# Altium schematic sheet POWER+HALL.SchDoc (part 1 of 3)
size B; CompanyName: Microchip Technology Inc.; Organization: Microchip Technology; Address1: 2355 West Chandler Blvd.; Address2: Chandler, AZ  85224; Address4: USA; DocumentNumber: 3; SheetNumber: 3; SheetTotal: 3; SheetTitle: POWER+HALL; Time: Time
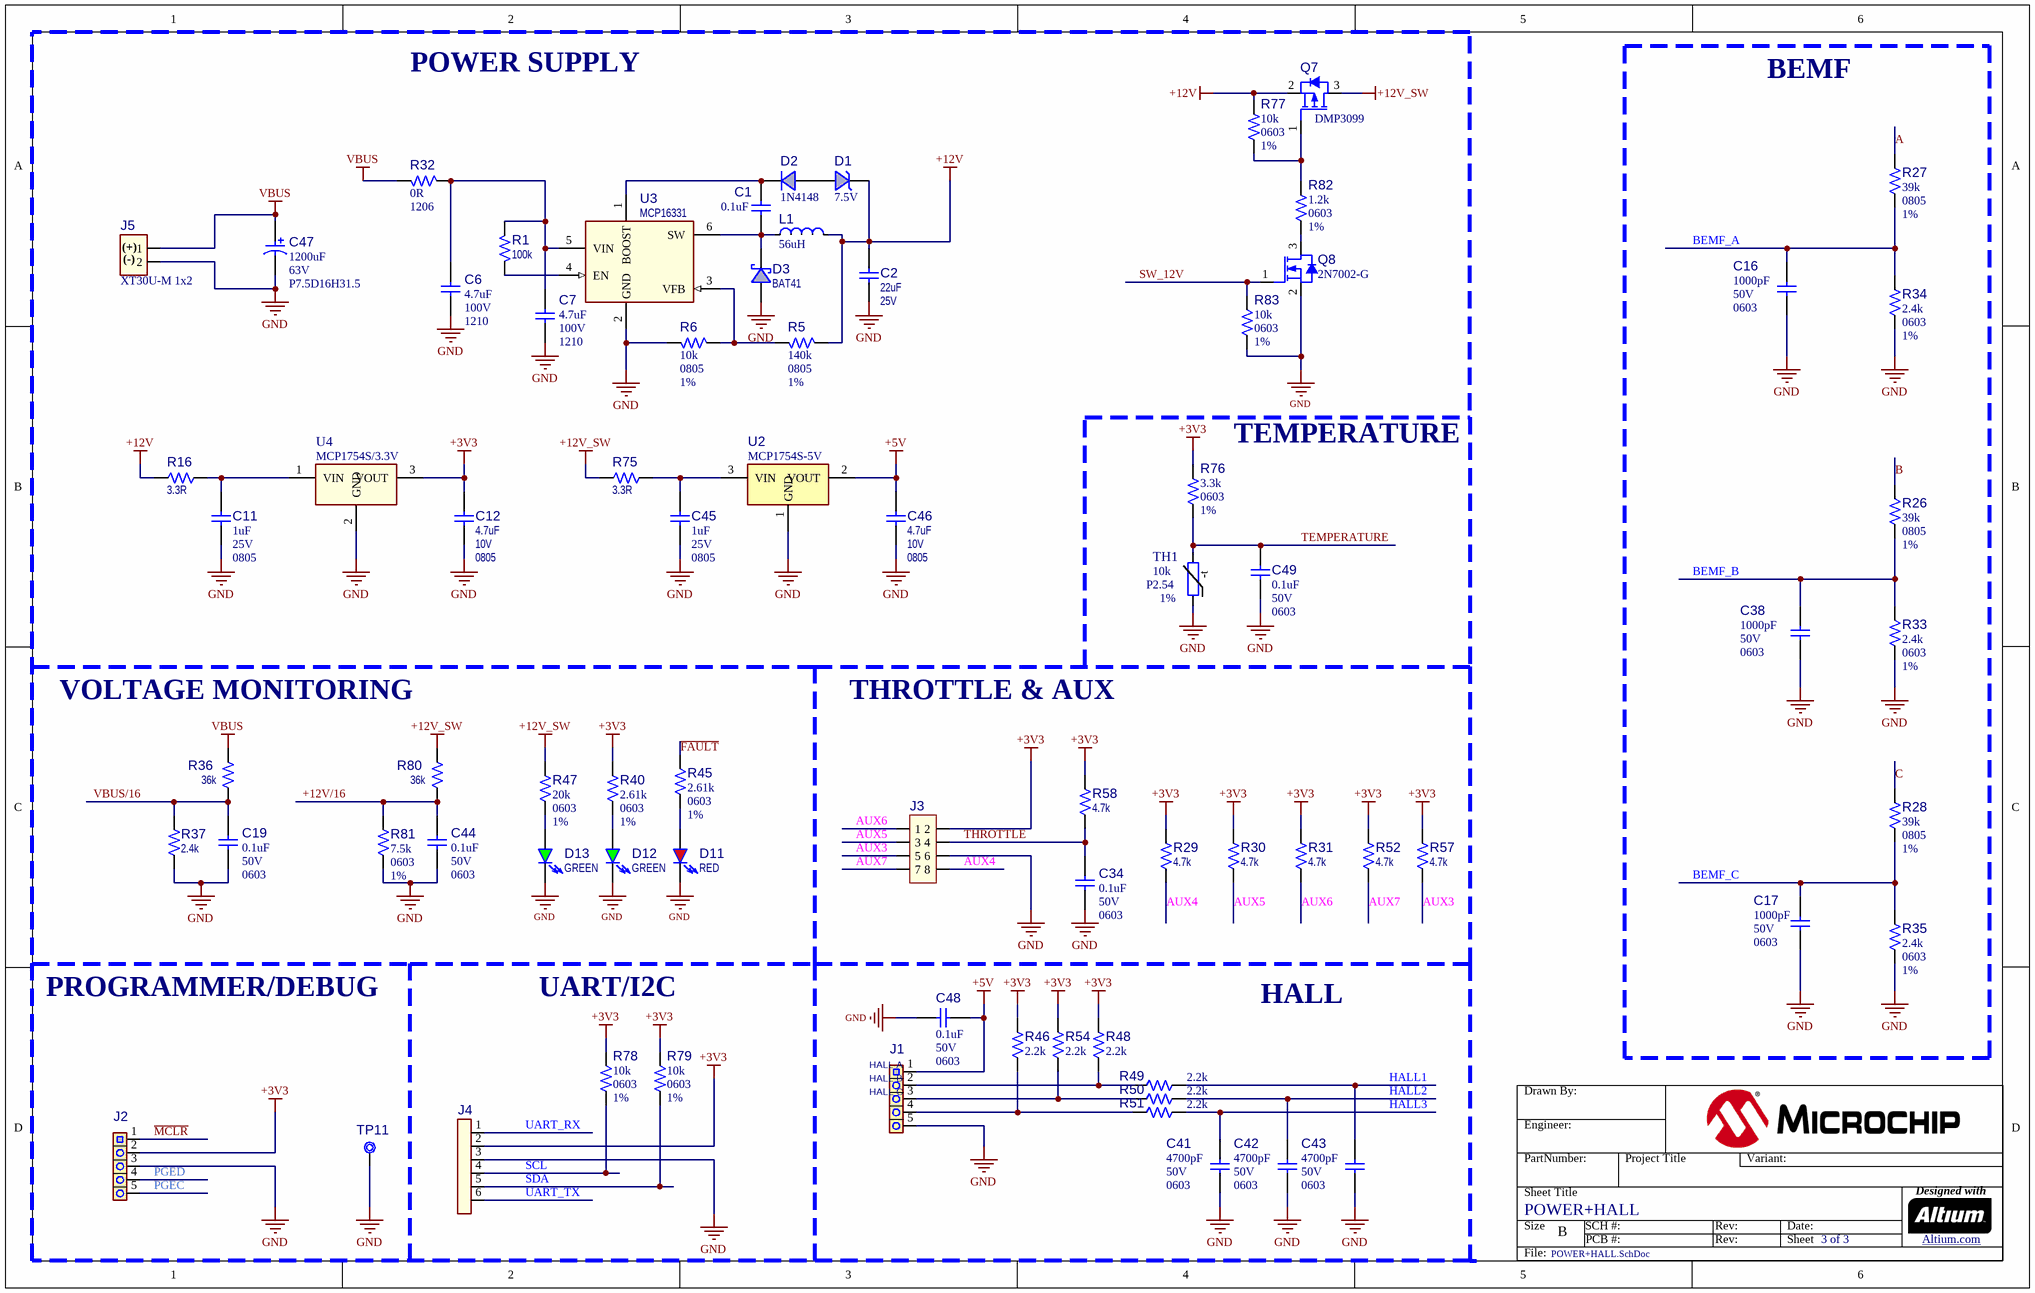
[diagram p0: POWER+HALL.SchDoc]

## Parts
?  (no value)  (graphical)
C1  value 0.1uF  [CAP_C_0603]  (hidden comment: Capacitor NP)
C2  value 22uF  Voltage: 25V  [CAP_C_1206]  (hidden comment: Capacitor NP)
C6  value 4.7uF  Voltage: 100V  Package: 1210  [CAP_C_1210]  (hidden comment: Capacitor NP)
C7  value 4.7uF  Voltage: 100V  Package: 1210  [CAP_C_1210]  (hidden comment: Capacitor NP)
C11  value 1uF  Voltage: 25V  Package: 0805  [CAP_C_0805]  (hidden comment: Capacitor NP)
C12  value 4.7uF  Voltage: 10V  Package: 0805  [CAP_C_0805]  (hidden comment: Capacitor NP)
C16  value 1000pF  Voltage: 50V  Package: 0603  [CAP_C_0603]  (hidden comment: Capacitor NP)
C17  value 1000pF  Voltage: 50V  Package: 0603  [CAP_C_0603]  (hidden comment: Capacitor NP)
C19  value 0.1uF  Voltage: 50V  Package: 0603  [CAP_C_0603]  (hidden comment: Capacitor NP)
C34  value 0.1uF  Voltage: 50V  Package: 0603  [CAP_C_0603]  (hidden comment: Capacitor NP)
C38  value 1000pF  Voltage: 50V  Package: 0603  [CAP_C_0603]  (hidden comment: Capacitor NP)
C41  value 4700pF  Voltage: 50V  Package: 0603  [CAP_C_0603]  (hidden comment: Capacitor NP)
C42  value 4700pF  Voltage: 50V  Package: 0603  [CAP_C_0603]  (hidden comment: Capacitor NP)
C43  value 4700pF  Voltage: 50V  Package: 0603  [CAP_C_0603]  (hidden comment: Capacitor NP)
C44  value 0.1uF  Voltage: 50V  Package: 0603  [CAP_C_0603]  (hidden comment: Capacitor NP)
C45  value 1uF  Voltage: 25V  Package: 0805  [CAP_C_0805]  (hidden comment: Capacitor NP)
C46  value 4.7uF  Voltage: 10V  Package: 0805  [CAP_C_0805]  (hidden comment: Capacitor NP)
C47  value 1200uF  Voltage: 63V  Package: P7.5D16H31.5  [CAP_RAD_P7.5D16H31.5]  (hidden comment: Capacitor POL)
C48  value 0.1uF  Voltage: 50V  Package: 0603  [CAP_C_0603]  (hidden comment: Capacitor NP)
C49  value 0.1uF  Voltage: 50V  Package: 0603  [CAP_C_0603]  (hidden comment: Capacitor NP)
D1  value 7.5V  [SOD-123]  (hidden comment: Diode Zener)
D2  value 1N4148  [SOD-323]  (hidden comment: Diode Single)
D3  value BAT41  [SOD-123]  (hidden comment: Diode Schottky)
D11  value RED  [LED_0603_RED]  (hidden comment: LED_red)
D12  value GREEN  [LED_0603_GREEN]  (hidden comment: LED_green)
D13  value GREEN  [LED_0603_GREEN]  (hidden comment: LED_green)
J1  Header 1x5  [HDR_M_2.54_1x5]  (value not drawn)
J2  Header 1x5  [HDR_M_2.54_1x5]  (value not drawn)
J3  Header 2x4  [HDR_M_2.54_2x4]  (value not drawn)
J4  Header 1x6  [HDR_M_2.54_1x6]  (value not drawn)
J5  value XT30U-M 1x2  [CON TERMINAL XT30U-M 5mm 1x2 Male 30A TH V]  (hidden comment: CON 1x2 POLARIZED)
L1  value 56uH  [IND_WE_WE-PD_L7.3W7.3H4.5]  (hidden comment: Inductor)
Q7  value DMP3099  [SOT-23-3]  (hidden comment: Transistor MOS-P GSD)
Q8  value 2N7002-G  [SOT-23-3]  (hidden comment: Transistor MOS-N GSD)
R1  value 100k  [RES_C_0603]  (hidden comment: Resistor)
R5  value 140k  Package: 0805  Tolerance: 1%  [RES_C_0805]  (hidden comment: Resistor)
R6  value 10k  Package: 0805  Tolerance: 1%  [RES_C_0805]  (hidden comment: Resistor)
R16  value 3.3R  [RES_C_0805]  (hidden comment: Resistor)
R26  value 39k  Package: 0805  Tolerance: 1%  [RES_C_0805]  (hidden comment: Resistor)
R27  value 39k  Package: 0805  Tolerance: 1%  [RES_C_0805]  (hidden comment: Resistor)
R28  value 39k  Package: 0805  Tolerance: 1%  [RES_C_0805]  (hidden comment: Resistor)
R29  value 4.7k  [RES_C_0603]  (hidden comment: Resistor)
R30  value 4.7k  [RES_C_0603]  (hidden comment: Resistor)
R31  value 4.7k  [RES_C_0603]  (hidden comment: Resistor)
R32  value 0R  Package: 1206  [RES_C_1206]  (hidden comment: Resistor)
R33  value 2.4k  Package: 0603  Tolerance: 1%  [RES_C_0603]  (hidden comment: Resistor)
R34  value 2.4k  Package: 0603  Tolerance: 1%  [RES_C_0603]  (hidden comment: Resistor)
R35  value 2.4k  Package: 0603  Tolerance: 1%  [RES_C_0603]  (hidden comment: Resistor)
R36  value 36k  [RES_C_0805]  (hidden comment: Resistor)
R37  value 2.4k  [RES_C_0603]  (hidden comment: Resistor)
R40  value 2.61k  Package: 0603  Tolerance: 1%  [RES_C_0603]  (hidden comment: Resistor)
R45  value 2.61k  Package: 0603  Tolerance: 1%  [RES_C_0603]  (hidden comment: Resistor)
R46  value 2.2k  [RES_C_0603]  (hidden comment: Resistor)
R47  value 20k  Package: 0603  Tolerance: 1%  [RES_C_0603]  (hidden comment: Resistor)
R48  value 2.2k  [RES_C_0603]  (hidden comment: Resistor)
R49  value 2.2k  [RES_C_0603]  (hidden comment: Resistor)
R50  value 2.2k  [RES_C_0603]  (hidden comment: Resistor)
R51  value 2.2k  [RES_C_0603]  (hidden comment: Resistor)
R52  value 4.7k  [RES_C_0603]  (hidden comment: Resistor)
R54  value 2.2k  [RES_C_0603]  (hidden comment: Resistor)
R57  value 4.7k  [RES_C_0603]  (hidden comment: Resistor)
R58  value 4.7k  [RES_C_0603]  (hidden comment: Resistor)
R75  value 3.3R  [RES_C_0805]  (hidden comment: Resistor)
R76  value 3.3k  Package: 0603  Tolerance: 1%  [RES_C_0603]  (hidden comment: Resistor)
R77  value 10k  Package: 0603  Tolerance: 1%  [RES_C_0603]  (hidden comment: Resistor)
R78  value 10k  Package: 0603  Tolerance: 1%  [RES_C_0603]  (hidden comment: Resistor)
R79  value 10k  Package: 0603  Tolerance: 1%  [RES_C_0603]  (hidden comment: Resistor)
R80  value 36k  [RES_C_0805]  (hidden comment: Resistor)
R81  value 7.5k  Package: 0603  Tolerance: 1%  [RES_C_0603]  (hidden comment: Resistor)
R82  value 1.2k  Package: 0603  Tolerance: 1%  [RES_C_0603]  (hidden comment: Resistor)
R83  value 10k  Package: 0603  Tolerance: 1%  [RES_C_0603]  (hidden comment: Resistor)
TH1  value 10k  Package: P2.54  Tolerance: 1%  [Thermistor_Wired_P1.5]  (hidden comment: Thermistor NTC)
TP11  Test Point No BOM  [TP_3.4x5_SMD_NOBOM]  (value not drawn)  (no BOM)
U2  value MCP1754S-5V  [SOT-23A-3]  (hidden comment: MCP1754ST-5002ECB SOT-23A-3)
U3  value MCP16331  [SOT-23-6]  (hidden comment: MCP16331 SOT-23-6)
U4  value MCP1754S/3.3V  [SOT-223-3]  (hidden comment: MCP1754S SOT-89-3_SOT-223-3)

## Blocks framed on the sheet
BEMF: C16 C17 C38 R26-R28 R33-R35

## Nets
+3V3: C12.2 J2.2(P2) J3.2 J4.2 R29.2 R30.2 R31.2 R40.2 R46.2 R48.2 R52.2 R54.2 R57.2 R58.2 R76.2 R78.2 R79.2 U4.3(VOUT)
+5V: C46.2 C48.1 J1.1(P1) U2.2(VOUT)
+12V: C2.1 D1.2(K) L1.1(S) Q7.2(S) R5.1 R16.1 R77.2
+12V_SW: Q7.3(D) R47.2 R75.1 R80.2
GND: C2.2 C6.1 C7.1 C11.1 C12.1 C16.1 C17.1 C19.1 C34.1 C38.1 C41.1 C42.1 C43.1 C44.1 C45.1 C46.1 C47.2 C48.2 C49.2 D3.1(A) D11.2(K) D12.2(K) D13.2(K) J1.5(P5) J2.3(P3) J3.6 J4.3 J5.2 Q8.2(S) R6.2 R33.1 R34.1 R35.1 R37.1 R81.1 R83.1 TH1.1 TP11.1 U2.1(GND) U3.2(GND) U4.2(GND)
VBUS: C47.1 J5.1 R32.2 R36.2
+12V/16: C44.2 R80.1 R81.2
~{FAULT}: R45.2
~{MCLR}: J2.1(P1)
A: R27.2
AUX3: J3.5 R57.1
AUX4: J3.8 R29.1
AUX5: J3.3 R30.1
AUX6: J3.1 R31.1
AUX7: J3.7 R52.1
B: R26.2
BEMF_A: C16.2 R27.1 R34.2
BEMF_B: C38.2 R26.1 R33.2
BEMF_C: C17.2 R28.1 R35.2
C: R28.2
HALL1: C43.2 R49.2
HALL2: C42.2 R50.2
HALL3: C41.2 R51.2
PGEC: J2.5(P5)
PGED: J2.4(P4)
SCL: J4.4 R78.1
SDA: J4.5 R79.1
SW_12V: Q8.1(G) R83.2
TEMPERATURE: C49.1 R76.1 TH1.2
THROTTLE: C34.2 J3.4 R58.1
UART_RX: J4.1
UART_TX: J4.6
VBUS/16: C19.2 R36.1 R37.2
NetC1_1: C1.1 D3.2(K) L1.2(F) U3.6(SW)
NetC1_2: C1.2 D2.2(K) U3.1(BOOST)
NetC6_2: C6.2 C7.2 R1.2 R32.1 U3.5(VIN)
NetC11_2: C11.2 R16.2 U4.1(VIN)
NetC45_2: C45.2 R75.2 U2.3(VIN)
NetD1_1: D1.1(A) D2.1(A)
NetD11_1: D11.1(A) R45.1
NetD12_1: D12.1(A) R40.1
NetD13_1: D13.1(A) R47.1
NetJ1_2: J1.2(P2) R48.1 R49.1
NetJ1_3: J1.3(P3) R50.1 R54.1
NetJ1_4: J1.4(P4) R46.1 R51.1
NetQ7_1: Q7.1(G) R77.1 R82.2
NetQ8_3: Q8.3(D) R82.1
NetR1_1: R1.1 U3.4(EN)
NetR5_2: R5.2 R6.1 U3.3(VFB)

## Notes on the sheet
- POWER SUPPLY
- (near R76) TEMPERATURE
- VOLTAGE MONITORING
- THROTTLE & AUX
- PROGRAMMER/DEBUG
- UART/I2C
- HALL
- (near J1) HALL A
- (near J1) HALL B
- (near J1) HALL C
- Drawn By:
- Engineer:
- PartNumber:
- Project Title
- Variant:
- Sheet Title
- Size
- B
- SCH #:
- PCB #:
- Rev:
- Date:
- Sheet
- Designed with
- Altium.com <http://go.altium.com/MicrochipLandingPage_Evaluation.html>
- File:
- (in symbol CON2207) (+); (-)
- (in symbol RES2734) -t